# EasyEDA Pro project EasyEDA.eprj

# Schematic (NEW) SRP 70*50mm
Create Date: 2023-02-23; Page Name: Solder Reflow Plate; Project Name: EasyEDA; Schematic Name: (NEW) SRP 70*50mm; Update Date: 2023-02-23; Drawed: Fran Quero; Page Size: A4; Part Number: JLCPCB-002; Reviewed: Fran Quero; Version: V0.1
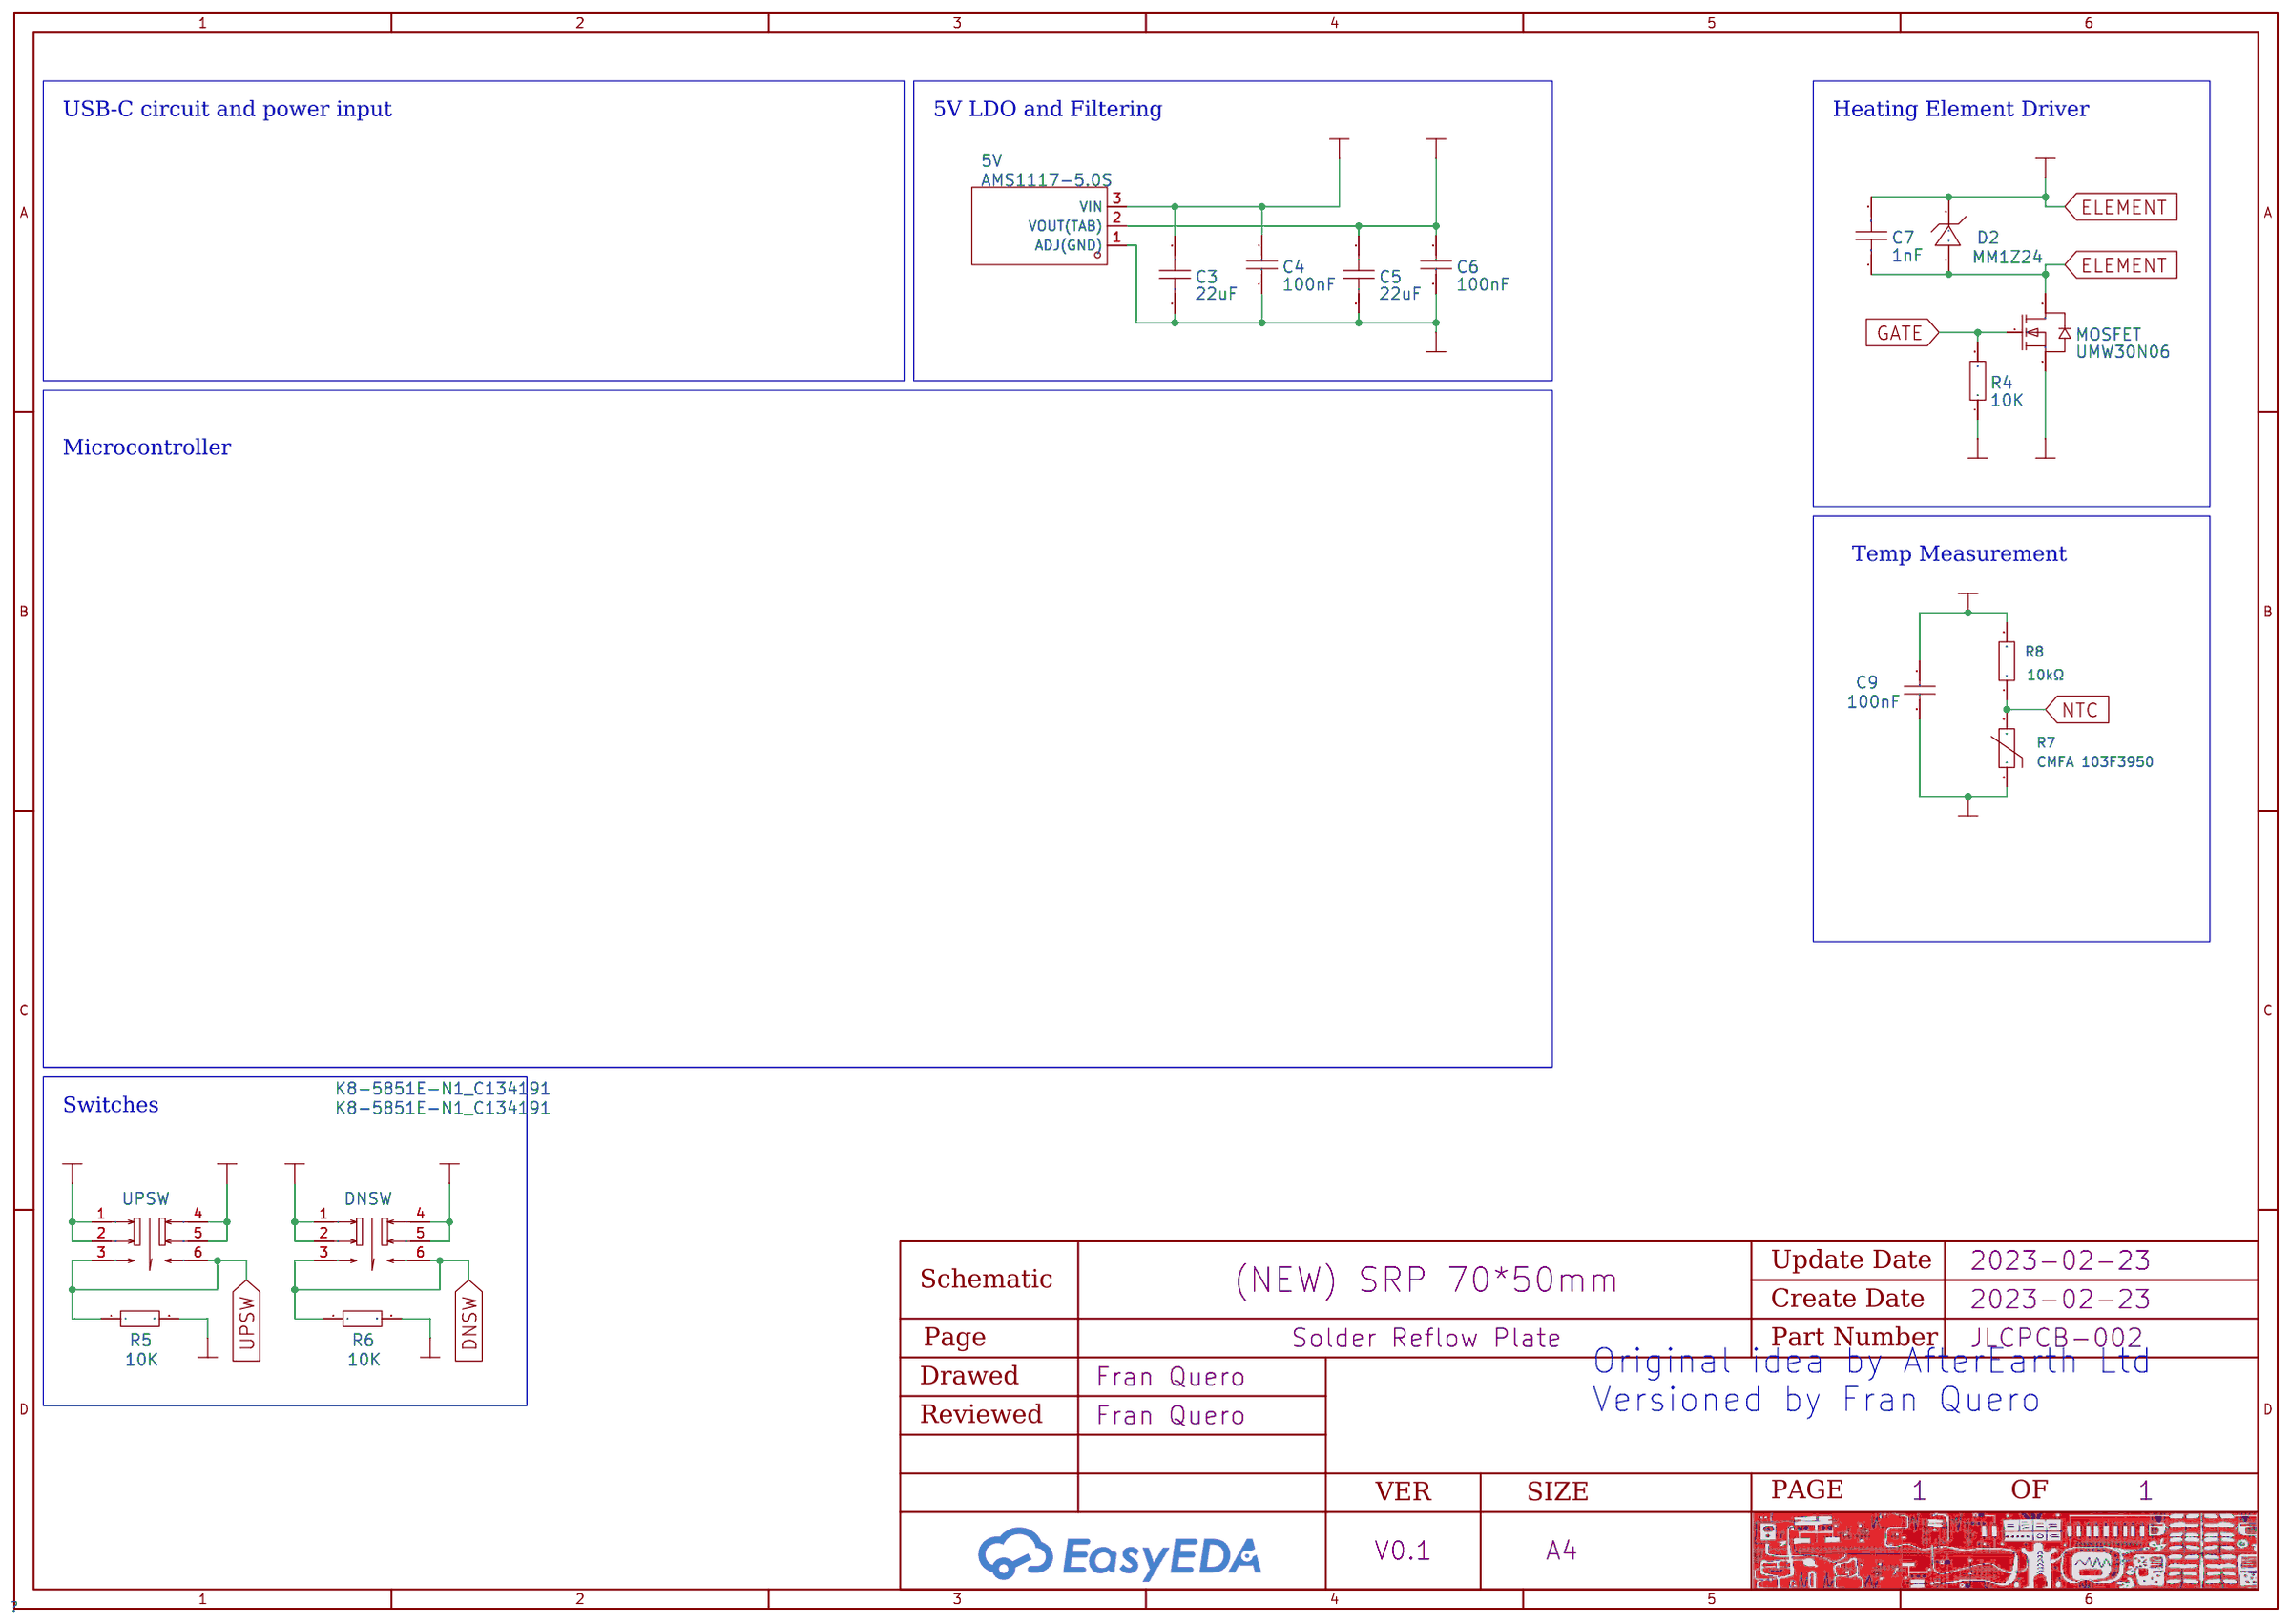
[diagram p0: schematic sheet]

## Parts
5V  AMS1117-5.0S  [SOT-89_L4.5-W2.5-P1.50-LS4.2-BR]
C3  22uF  [C0805]
C4  100nF  [C0603]
C5  22uF  [C0805]
C6  100nF  [C0603]
C7  1nF  [C0805]
C9  100nF  [C0603]
D2  MM1Z24  [SOD-123_L2.8-W1.8-LS3.7-FD]
DNSW  K8-5851E-N1_C134191  [SW-TH_6P-L5.8-W5.8-P2.00-LS4.5-BL]
MOSFET  UMW30N06  [TO-252-2_L6.6-W6.1-P4.57-LS9.9-BR-CW]
R4  10K  [R0603]
R5  10K  [R0603]
R6  10K  [R0603]
R7  CMFA 103F3950  [R0603]
R8  10kΩ  [R0603]
UPSW  K8-5851E-N1_C134191  [SW-TH_6P-L5.8-W5.8-P2.00-LS4.5-BL]

## Library data of the parts
5V = AMS1117-5.0S: link: https://item.szlcsc.com/236145.html; 3DModel: SOT-89-3_L4.3-W2.5-H1.6-LS4.1-P1.50; Supplier: LCSC; Supplier Part: C351450; Manufacturer: Youtai Semiconductor Co., Ltd.; JLCPCB Part Class: Extended Part
C3 C5 = 22uF: link: https://item.szlcsc.com/373011.html; 3DModel: C0805_L2.0-W1.3-H1.3; Supplier: LCSC; Supplier Part: C602037; Manufacturer: Samsung Electro-Mechanics; Manufacturer Part: CL21A226MAYNNNE; JLCPCB Part Class: Extended Part
C4 C6 C9 = 100nF: link: https://item.szlcsc.com/362304.html; 3DModel: C0603_L1.6-W0.8-H0.8; Supplier: LCSC; Manufacturer: WTC; Manufacturer Part: 0603B104K250; Supplier Part: C83054; JLCPCB Part Class: Extended Part
C7 = 1nF: link: https://item.szlcsc.com/373011.html; 3DModel: C0805_L2.0-W1.3-H1.3; Supplier: LCSC; Supplier Part: C440004; Manufacturer: PSA(Prosperity Dielectrics); Manufacturer Part: FM21X102K501PXG
D2 = MM1Z24: link: https://item.szlcsc.com/182946.html; 3DModel: SOD-123_L2.8-W1.8-H1.4-LS3.7; Supplier: LCSC; Manufacturer: SEMTECH; Supplier Part: C82522; JLCPCB Part Class: Extended Part
DNSW UPSW = K8-5851E-N1_C134191: link: https://item.szlcsc.com/235656.html; Supplier: LCSC; Manufacturer: HRO; Manufacturer Part: K8-5851E-N1; Supplier Part: C134191; JLCPCB Part Class: Extended Part
MOSFET = UMW30N06: link: https://item.szlcsc.com/176608.html; 3DModel: TO-252-2L-3P_L6.6-W6.1-H2.3-LS10.1-P4.6; Supplier: LCSC; Supplier Part: C369599; Manufacturer: Youtai Semiconductor Co., Ltd.; JLCPCB Part Class: Extended Part
R4-R6 = 10K: 3DModel: R0603_L1.6-W0.8-H0.8; link: https://www.mouser.in/datasheet/2/447/PYu_RT_1_to_0_01_RoHS_L_11-1669912.pdf; Supplier: LCSC; Manufacturer: RALEC; Manufacturer Part: RTT03103JTP; Supplier Part: C103210; JLCPCB Part Class: Extended Part
R7 = CMFA 103F3950: Resistance @ 25℃: Resistance Tolerance: B Constant Tolerance:- B Constant (25℃/50℃): Power: Steady State Current (Max):0.31mA B Constant (25℃/75℃):- B Constant (25℃/85℃):3987K B Constant (25℃/100℃):- Operating Temperature:-40℃~+125℃ Operating Temperature:; LCSC Part Name: 10kΩ 电阻精度:±1% 3950K; Supplier Part: C2889049; Manufacturer: 时恒; Supplier Footprint: 0603; JLCPCB Part Class: Extended Part; Datasheet: https://atta.szlcsc.com/upload/public/pdf/source/20210906/B03A8E165737D41272F439C17FAA3AAF.pdf; Supplier: LCSC; Steady State Current (Max): 0.31mA; B Constant (25℃/85℃): 3987K; Operating Temperature: -40℃~+125℃
R8 = ARG03BTC1002: Temperature Coefficient: Temperature Coefficient: Resistance: Tolerance: Power(Watts): Operating Temperature Range: Operating Temperature Range: Type:Thin Film Resistor Overload Voltage (Max):; LCSC Part Name: 10kΩ ±0.1%; Supplier Part: C309083; Manufacturer: Viking(光颉); Supplier Footprint: 0603; JLCPCB Part Class: Extended Part; Datasheet: https://atta.szlcsc.com/upload/public/pdf/source/20180927/C309083_646512A0E222CA692A136FBD28365627.pdf; Supplier: LCSC; Type: Thin Film Resistor

## Nets
0V: 5V.1(ADJ(GND)) C3.1 C4.2 C5.1 C6.2 C9.2 MOSFET.3(S) R4.1 R5.2 R6.2 R7.1
5V+: 5V.2(VOUT(TAB)) C5.2 C6.1 C9.1 DNSW.1 DNSW.2 DNSW.4 DNSW.5 R8.2 UPSW.1 UPSW.2 UPSW.4 UPSW.5
VCC: C7.1 C7.2 D2.1(A) D2.2(K) MOSFET.2(D)
VIN-D: 5V.3(VIN) C3.2 C4.1
DNSW: DNSW.3 DNSW.6 R6.1
GATE: MOSFET.1(G) R4.2
NTC: R7.2 R8.1
UPSW: R5.1 UPSW.3 UPSW.6

## Notes on the sheet
- USB-C circuit and power input
- 5V LDO and Filtering
- Heating Element Driver
- Microcontroller
- Temp Measurement
- Switches
- Original idea by AfterEarth Ltd
  Versioned by Fran Quero

# Board PCB_SRP 70 50mm_Release_2022-03-04
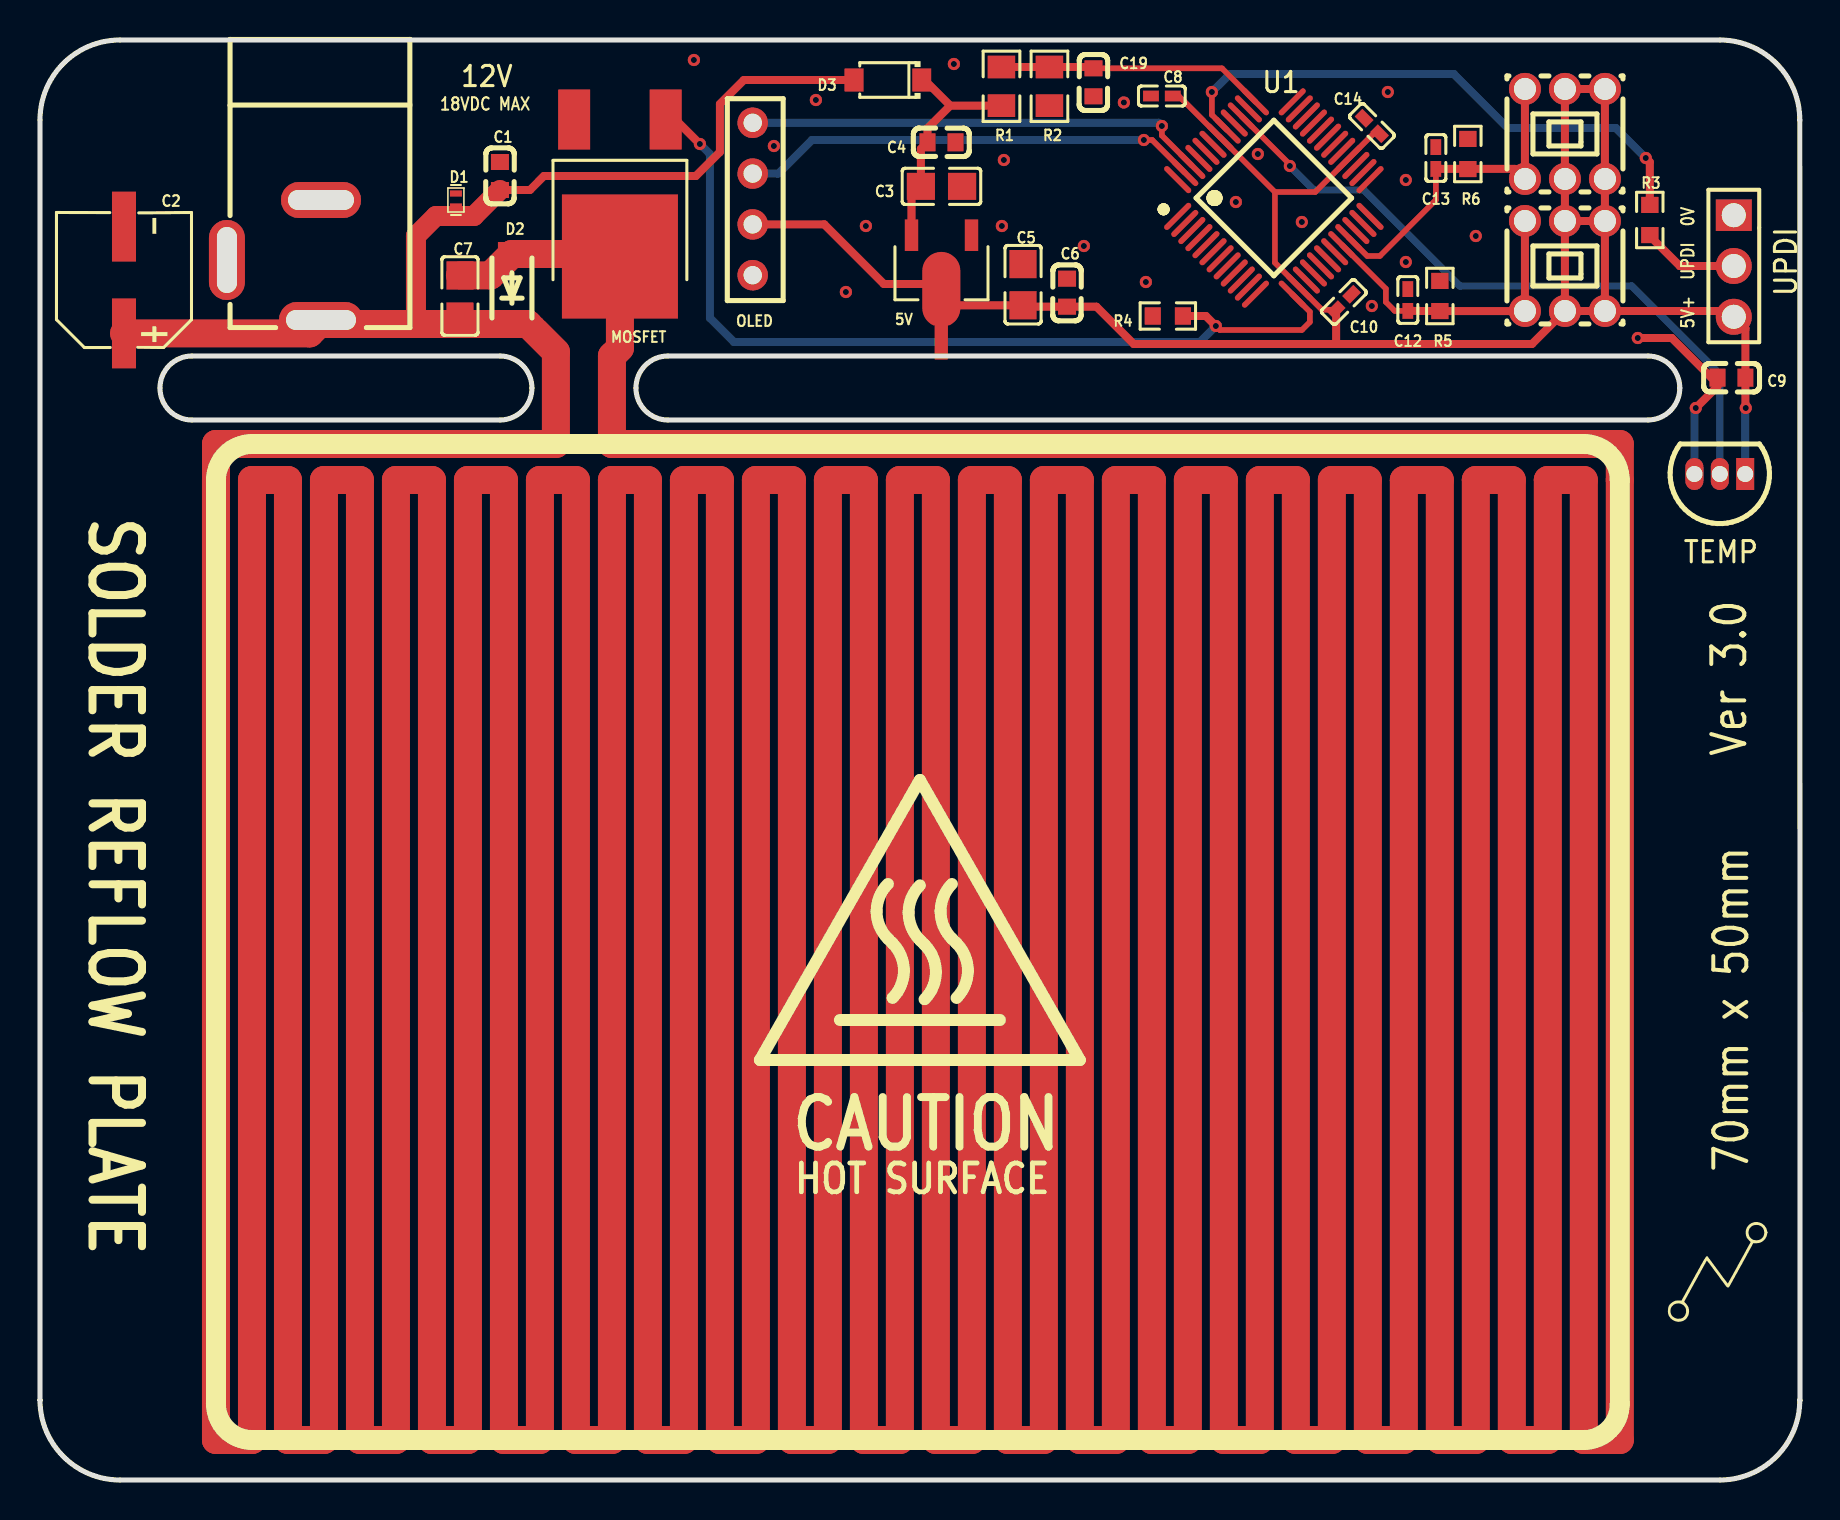
[diagram p1: board, top side]
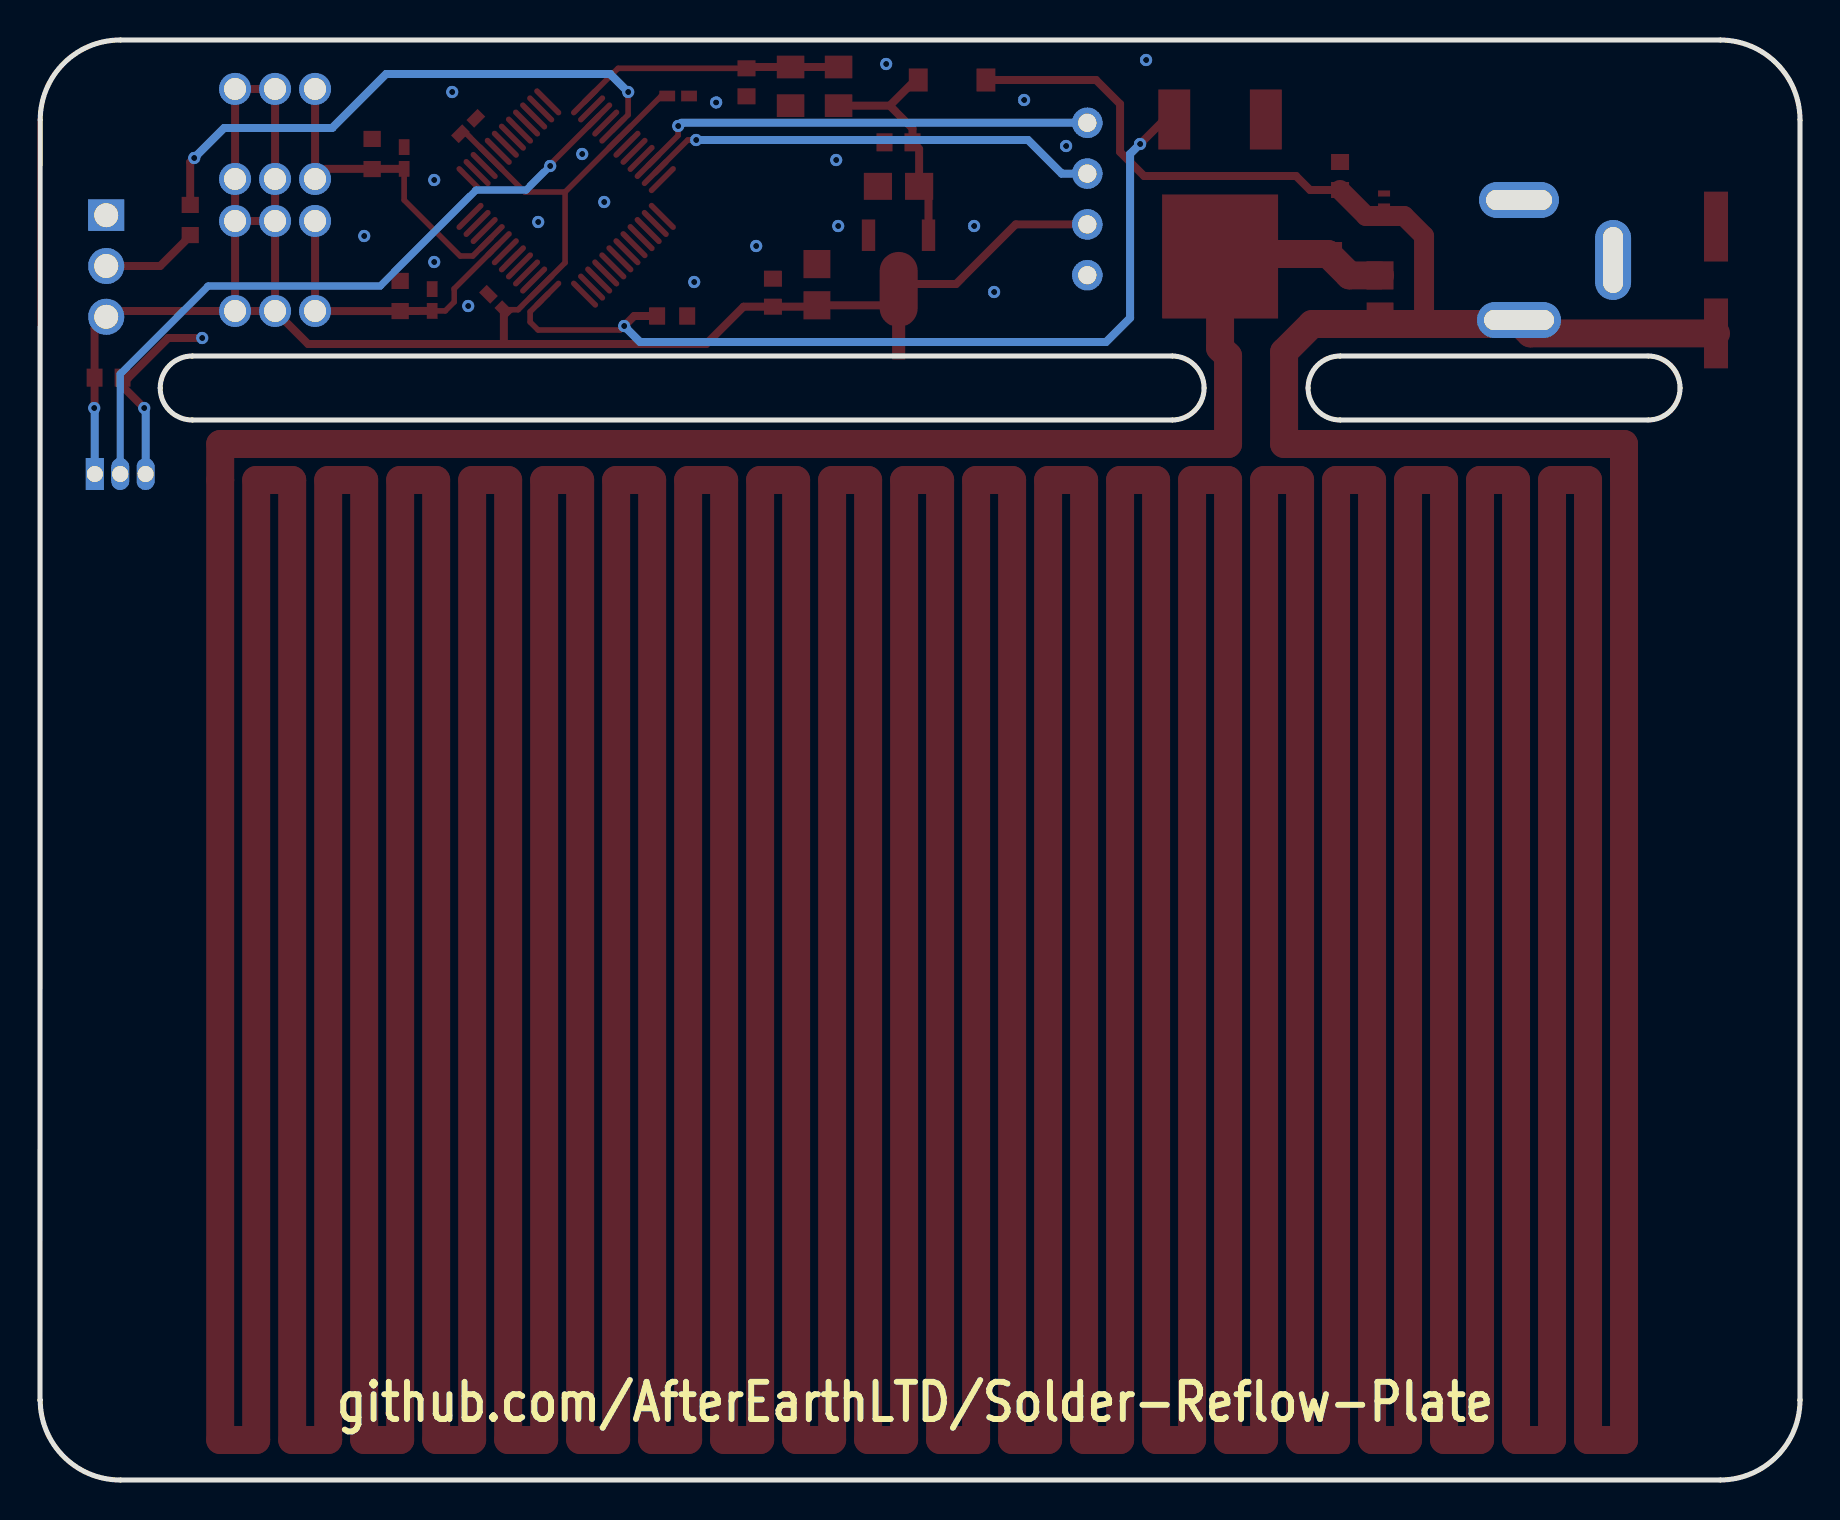
[diagram p2: board, bottom side, seen from below]

Outline 88.01 x 72 mm; copper layers: Top Layer, Bottom Layer. Coordinates in mm from the lower left corner of the outline.
Outline path: 0,68 arc(1.17,70.83) 4,72 84,72 arc(86.83,70.83) 88,68 88.01,3.99 88,4 arc(86.83,1.17) 84,0 4,0 arc(1.17,1.17) 0,4 0,3.99 0,68 ; 6,54.6 arc(6.47,55.73) 7.6,56.2 23,56.2 arc(24.13,55.73) 24.6,54.6 arc(24.13,53.47) 23,53 7.6,53 arc(6.47,53.47) 6,54.6 ; 29.8,54.6 arc(30.27,55.73) 31.4,56.2 80.4,56.2 arc(81.53,55.73) 82,54.6 arc(81.53,53.47) 80.4,53 31.4,53 arc(30.27,53.47) 29.8,54.6
Stack: Top Layer 0.035mm / Dielectric1 1.51mm FR4 er 4.5 / Bottom Layer 0.035mm

## Design rules (mm)
spacing Default (default): track to track 0.152, other pairs 0 to 0.152
track width Default (default): min 0.254, default 0.254, max 25.4
differential pair differentialPair (default): width min 0.127, default 0.254, max 2.54; gap min 0.152, default 0.152
via Default (default): diameter min 0.61, default 0.61, max 100.025; hole min 0.305, default 0.305, max 59.995
net 0V uses gge10662(1)
net VCC uses gge5122
pour e241 uses gge5122
pour e242 uses gge10662(1)

## Placement (name value [footprint] x y rotation side)
5V  AMS1117-5.0S  [SOT-89_L4.5-W2.5-P1.50-LS4.2-BR]  45.08 60.88 90 top
12V  DC-005-5A-2.5  [DC-IN-TH_DC-005-5A-2.5]  11.7 61 270 top
C1  100nF  [C0603]  23 65.2 270 top
C2  100uF  [CAP-SMD_BD6.3-L6.6-W6.6-LS7.6-FD]  4.2 60 90 top
C3  22uF  [C0805]  45.08 64.68 180 top
C4  100nF  [C0603]  45.08 66.88 0 top
C5  22uF  [C0805]  49.16 59.77 270 top
C6  100nF  [C0603]  51.36 59.36 90 top
C7  1nF  [C0805]  21 59.2 90 top
C8  10nF  [C0402]  56.1 69.2 0 top
C9  100nF  [C0603]  84.58 55.12 180 top
C10  10nF  [C0402]  65.2 58.9 225 top
C12  10nF  [C0402]  68.4 59 270 top
C13  10nF  [C0402]  69.8 66.1 270 top
C14  10nF  [C0402]  66.6 67.7 315 top
C19  100nF  [C0603]  52.68 69.88 90 top
D1  PESDMC2FD18VB  [SOD-882_L1.0-W0.6-BI]  20.8 64 270 top
D2  MM1Z24  [SOD-123_L2.8-W1.8-LS3.7-FD]  23.6 59.6 270 top
D3  DSR1M_C908221  [SOD-123_L2.8-W1.8-LS3.7-RD]  42.4 70 180 top
DNSW  K8-5851E-N1_C134191  [SW-TH_6P-L5.8-W5.8-P2.00-LS4.5-BL]  76.26 67.3 180 top
MOSFET  UMW30N06  [TO-252-2_L6.6-W6.1-P4.57-LS9.9-BR-CW]  29 64.6 90 top
OLED  OLED 0.91"  [OLED_0.91_128X32]  33.1 70.4 0 top
R1  3K  [R0805]  48.08 69.68 90 top
R2  1K  [R0805]  50.48 69.68 90 top
R3  4.7K  [R0603]  80.5 63 90 top
R4  10K  [R0603]  56.4 58.2 0 top
R5  10K  [R0603]  70 59.2 90 top
R6  10K  [R0603]  71.4 66.3 90 top
TEMP  LMT85LP  [TO-92-3_L4.9-W3.7-P1.27-L]  84 50.3 180 top
U1  ATMEGA4809-AFR  [TQFP-48_L7.0-W7.0-P0.50-LS9.0-BL]  61.7 64.1 315 top
UPDI  Header-Male-2.54_1x3  [HDR-TH_3P-P2.54-V-M-1]  84.7 60.7 270 top
UPSW  K8-5851E-N1_C134191  [SW-TH_6P-L5.8-W5.8-P2.00-LS4.5-BL]  76.26 60.7 180 top

## Footprints (pads in the part's own frame, mm; a bottom-side part is the same pattern mirrored in y, then rotated)
C0402
  rect 0.79x0.54 smd: 1(-0.545,0) 2(0.545,0)
C0603
  rect 0.8x0.9 smd: 1(-0.7,0) 2(0.7,0)
C0805
  rect 1.41x1.35 smd: 1(-1.03,0) 2(1.03,0)
CAP-SMD_BD6.3-L6.6-W6.6-LS7.6-FD
  rect 3.5x1.2 smd: 1(-2.67,0) 2(2.67,0)
DC-IN-TH_DC-005-5A-2.5
  oval 1.8x4.2 hole 1x3.5: 1(3,2.352)
  oval 1.8x4 hole 1x3.3: 2(-3,2.352)
  oval 4x1.8 hole 3.3x1: 3(-0.001,-2.352)
HDR-TH_3P-P2.54-V-M-1
  rect 1.575x1.8 hole 1.2: 1(-2.54,0)
  round 1.8 hole 1.2: 2(0,0) 3(2.54,0)
OLED_0.91_128X32
  round 1.524 hole 0.914: 1(2.54,-2.54) 2(2.54,-5.08) 3(2.54,-7.62) 4(2.54,-10.16)
R0603
  rect 0.806x0.864 smd: 1(-0.753,0) 2(0.753,0)
R0805
  rect 1.133x1.377 smd: 1(-0.967,0) 2(0.967,0)
SOD-123_L2.8-W1.8-LS3.7-FD
  rect 1.2x1.4 smd: 1(-1.7,0) 2(1.7,0)
SOD-123_L2.8-W1.8-LS3.7-RD
  rect 0.95x1.15 smd: 1(-1.692,0) 2(1.692,0)
SOD-882_L1.0-W0.6-BI
  rect 0.3x0.6 smd: 1(-0.325,0) 2(0.325,0)
SOT-89_L4.5-W2.5-P1.50-LS4.2-BR
  rect 1.575x0.672 smd: 1(1.357,-1.5) 3(1.357,1.5)
  custom 5.377x1.9 smd: 2(-1.357,0.009)
SW-TH_6P-L5.8-W5.8-P2.00-LS4.5-BL
  round 1.6 hole 1.1: 1(-2,-2.25) 2(0,-2.25) 3(2,-2.25) 4(-2,2.25) 5(0,2.25) 6(2,2.25)
TO-92-3_L4.9-W3.7-P1.27-L
  rect 0.9x1.6 hole 0.8: 1(-1.27,0)
  oval 0.9x1.6 hole 0.8: 2(0,0) 3(1.27,0)
TO-252-2_L6.6-W6.1-P4.57-LS9.9-BR-CW
  rect 3x1.6 smd: 1(3.424,-2.29) 3(3.424,2.29)
  rect 6.2x5.8 smd: 2(-3.424,0)
TQFP-48_L7.0-W7.0-P0.50-LS9.0-BL
  oval 0.28x1.8 smd: 1(-2.75,-4.05) 2(-2.25,-4.05) 3(-1.75,-4.05) 4(-1.249,-4.05) 5(-0.75,-4.05) 6(-0.25,-4.05) 7(0.25,-4.05) 8(0.75,-4.05) 9(1.25,-4.05) 10(1.75,-4.05) 11(2.25,-4.05) 12(2.75,-4.05) 25(2.751,4.05) 26(2.25,4.05) 27(1.75,4.05) 28(1.25,4.05) 29(0.75,4.05) 30(0.25,4.05) 31(-0.25,4.05) 32(-0.75,4.05) 33(-1.25,4.05) 34(-1.75,4.05) 35(-2.25,4.05) 36(-2.75,4.05)
  oval 1.8x0.28 smd: 13(4.05,-2.75) 14(4.05,-2.25) 15(4.05,-1.75) 16(4.05,-1.25) 17(4.05,-0.75) 18(4.05,-0.25) 19(4.05,0.25) 20(4.05,0.75) 21(4.05,1.25) 22(4.05,1.75) 23(4.05,2.25) 24(4.05,2.75) 37(-4.05,2.75) 38(-4.05,2.25) 39(-4.05,1.75) 40(-4.05,1.25) 41(-4.05,0.75) 42(-4.05,0.25) 43(-4.05,-0.25) 44(-4.05,-0.75) 45(-4.05,-1.25) 46(-4.05,-1.75) 47(-4.05,-2.25) 48(-4.05,-2.75)

## Nets
0V: 5V.1 12V.2 12V.3 C1.1 C2.2 C3.1 C4.2 C5.1 C6.2 C8.1 C9.2 C10.1 C12.1 C13.1 C14.1 C19.1 D1.1 MOSFET.3 OLED.4 R2.1 R4.1 R5.2 R6.2 TEMP.3 U1.15 U1.29 U1.43 UPDI.1
5V+: 5V.2 C5.2 C6.1 C8.2 C9.1 C10.2 C14.2 DNSW.1 DNSW.2 DNSW.4 DNSW.5 OLED.3 TEMP.1 U1.14 U1.28 U1.42 UPDI.3 UPSW.1 UPSW.2 UPSW.4 UPSW.5
VCC: 12V.1 C1.2 C2.1 C7.1 C7.2 D1.2 D2.1 D2.2 D3.2 MOSFET.2
VCCDIV: C19.2 R1.2 R2.2 U1.37
VIN-D: 5V.3 C3.2 C4.1 D3.1 R1.1
DNSW: C13.2 DNSW.3 DNSW.6 R6.1 U1.21
GATE: MOSFET.1 R4.2 U1.13
SCKOLED: OLED.2 U1.47
SDAOLED: OLED.1 U1.46
TEMPDATA: TEMP.2 U1.39
UPDI: R3.2 U1.41
UPDI_2: R3.1 UPDI.2
UPSW: C12.2 R5.1 U1.20 UPSW.3 UPSW.6

Pads without a net: U1 1 2 3 4 5 6 7 8 9 10 11 12 16 17 18 19 22 23 24 25 26 27 30 31 32 33 34 35 36 38 40 44 45 48

## Via types
v1: diameter 0.61, hole 0.305, Top Layer to Bottom Layer, 29 vias

## Routing (per net, layer and track width the routed paths; a pad name or vN(x,y) marks a point on that pad's centre or on a via; arc(x,y) is an arc through that point)
0V: length 10.1
  Top Layer w0.4: v1(79.9,57.1) 81.6,57.1 83.58,55.12 C9.2 83.88,54.68 v1(82.8,53.6)
  Bottom Layer w0.4: v1(82.8,53.6) 82.73,53.53 TEMP.3
  vias: v1(32.7,71) v1(36.7,66.7) v1(38.8,69) v1(40.3,59.4) v1(41.3,62.7) v1(45.7,70.8) v1(48.1,62.7) v1(48.2,66) v1(52.2,61.7) v1(54.2,68.88) v1(55.3,59.9) v1(59.8,63.9) v1(60.9,66.3) v1(63.1,62.9) v1(66.6,58.7) v1(67.4,69.4) v1(68.3,65) v1(68.3,60.9) v1(71.8,62.2)
5V+: length 109.5
  Top Layer w0.28: C14.2 66.68,67.31 U1.28 63.77,64.4 61.75,64.4 ; U1.42 61.75,64.4 ; 61.75,64.4 61.75,60.86 62.97,59.64 64.1,58.51 C10.2 ; C8.2 56.94,69.2 59.01,67.13
  Top Layer w0.4: UPSW.4 UPSW.5 DNSW.2 DNSW.1 UPSW.4 ; UPSW.4 84.41,58.45 UPDI.3 85.28,57.58 C9.1 85.28,53.62 v1(85.3,53.6) ; C10.2 64.81,56.8 ; 76.26,58.45 74.6,56.8 54.69,56.8 52.83,58.66 C6.1 49.23,58.67 C5.2 45.86,58.73 5V.2 44.8,59.8 42.2,59.8 39.22,62.78 OLED.3 ; UPSW.2 UPSW.1
  Bottom Layer w0.4: v1(85.3,53.6) 85.27,53.57 TEMP.1
VCC: length 2137.1
  Top Layer w0.4: D3.2 35.2,70 34,68.8 34,66.4 32.8,65.2 25.2,65.2 24.5,64.5 C1.2
  Top Layer w1: C1.2 21.7,63.2 19.8,63.2 18.8,62.2 18.8,57.8
  Top Layer w1.4: 79,50 79,51.8 28.6,51.8 28.6,56.2 29,56.6 MOSFET.2 28.88,61.3 D2.1 22.53,60.23 C7.2 ; C2.1 13.48,57.33 13.95,57.8 24.4,57.8 25.8,56.4 25.8,51.8 8.8,51.8 8.8,50 8.8,2 10.6,2 10.6,50 12.4,50 12.4,2 14.2,2 14.2,50 16,50 16,2 17.8,2 17.8,50 19.6,50 19.6,2 21.4,2 21.4,50 23.2,50 23.2,2 25,2 25,50 26.8,50 26.8,2 28.6,2 28.6,50 30.4,50 30.4,2 32.2,2 32.2,50 34,50 34,2 35.8,2 35.8,50 37.6,50 37.6,2 39.4,2 39.4,50 41.2,50 41.2,2 43,2 43,50 44.8,50 44.8,2 46.6,2 46.6,50 48.4,50 48.4,2 50.2,2 50.2,50 52,50 52,2 53.8,2 53.8,50 55.6,50 55.6,2 57.4,2 57.4,50 59.2,50 59.2,2 61,2 61,50 62.8,50 62.8,2 64.6,2 64.6,50 66.4,50 66.4,2 68.2,2 68.2,50 70,50 70,2 71.8,2 71.8,50 73.6,50 73.6,2 75.4,2 75.4,50 77.2,50 77.2,2 79,2 79,50
VCCDIV: length 13.4
  Top Layer w0.28: C19.2 59.11,70.58 U1.37
  Top Layer w0.4: C19.2 52.61,70.65 R1.2
VIN-D: length 11.8
  Top Layer w0.4: D3.1 44.23,70 45.52,68.72 ; 5V.3 43.58,64.21 C3.2 44.05,66.55 C4.1 44.38,67.58 45.52,68.72 ; 45.52,68.72 R1.1
DNSW: length 16.6
  Top Layer w0.28: U1.21 66.37,61.2 67,61.2 69.8,64 69.8,65.56
  Top Layer w0.4: 69.8,65.56 73.75,65.56 DNSW.6 DNSW.3
GATE: length 45.8
  Top Layer w0.28: 62.62,59.29 63.5,58.41 63.5,57.9 63.1,57.5 59,57.5 58.8,57.7
  Top Layer w0.4: v1(58.8,57.7) 58.3,58.2 R4.2 ; MOSFET.1 31.78,68.02 v1(33,66.8)
  Bottom Layer w0.4: v1(33,66.8) 33.5,66.3 33.5,58.1 34.7,56.9 58,56.9 v1(58.8,57.7)
SCKOLED: length 23
  Top Layer w0.28: v1(55.2,67) 55.62,67 57.25,65.37
  Bottom Layer w0.4: OLED.2 36.92,65.32 38.6,67 v1(55.2,67)
SDAOLED: length 23.1
  Top Layer w0.28: U1.46 56.1,67.22 v1(56.1,67.7)
  Bottom Layer w0.4: OLED.1 55.94,67.86 v1(56.1,67.7)
TEMPDATA: length 34.3
  Top Layer w0.28: U1.39 62.5,65.78 v1(62.5,65.7)
  Bottom Layer w0.36: 84,50.29 84,55.3 79.6,59.7 71,59.7 66.2,64.5 63.7,64.5 v1(62.5,65.7)
UPDI: length 28.5
  Top Layer w0.28: v1(58.6,69.4) 58.6,68.26 59.37,67.49
  Top Layer w0.4: v1(80.3,66.1) 80.5,65.9 80.5,63.75
  Bottom Layer w0.4: v1(80.3,66.1) 78.8,67.6 73.4,67.6 70.7,70.3 59.5,70.3 v1(58.6,69.4)
UPDI_2: length 4.9
  Top Layer w0.4: UPDI.2 82,60.7 80.5,62.2 R3.1
UPSW: length 15.5
  Top Layer w0.28: C12.2 67.74,58.45 67.3,58.9 67.3,59.56 U1.20
  Top Layer w0.4: UPSW.3 UPSW.6 74.25,58.45 R5.1 C12.2 68.4,58.4

## Copper pours and planes (outline as drawn; the poured copper is in the pictures)
0V on Top Layer: -2.15,74.45 88.55,74.45 90.55,72.45 90.55,56.05 90.45,55.95 -0.45,55.95 -1.55,57.05
0V on Bottom Layer: -2.55,74.45 88.15,74.45 90.15,72.45 90.15,56.05 90.05,55.95 -0.85,55.95 -1.95,57.05
VCC on Top Layer: 79.2,52.8 88.6,52.8 88.8,52.6 88.8,46.4 79.3,46.4 78.8,52.4

## Text on the board
Bottom Silkscreen Layer: github.com/AfterEarthLTD/Solder-Reflow-Plate
Document Layer: Switch Notch is on NO side. | Notch should point towards LCD.
Top Silkscreen Layer: 18VDC MAX | 5V+  UPDI  0V | HOT SURFACE | Ver 3.0 | 70mm x 50mm | CAUTION | SOLDER REFLOW PLATE
